# Altium schematic sheet FPGA SYSTERM.SchDoc
size A3
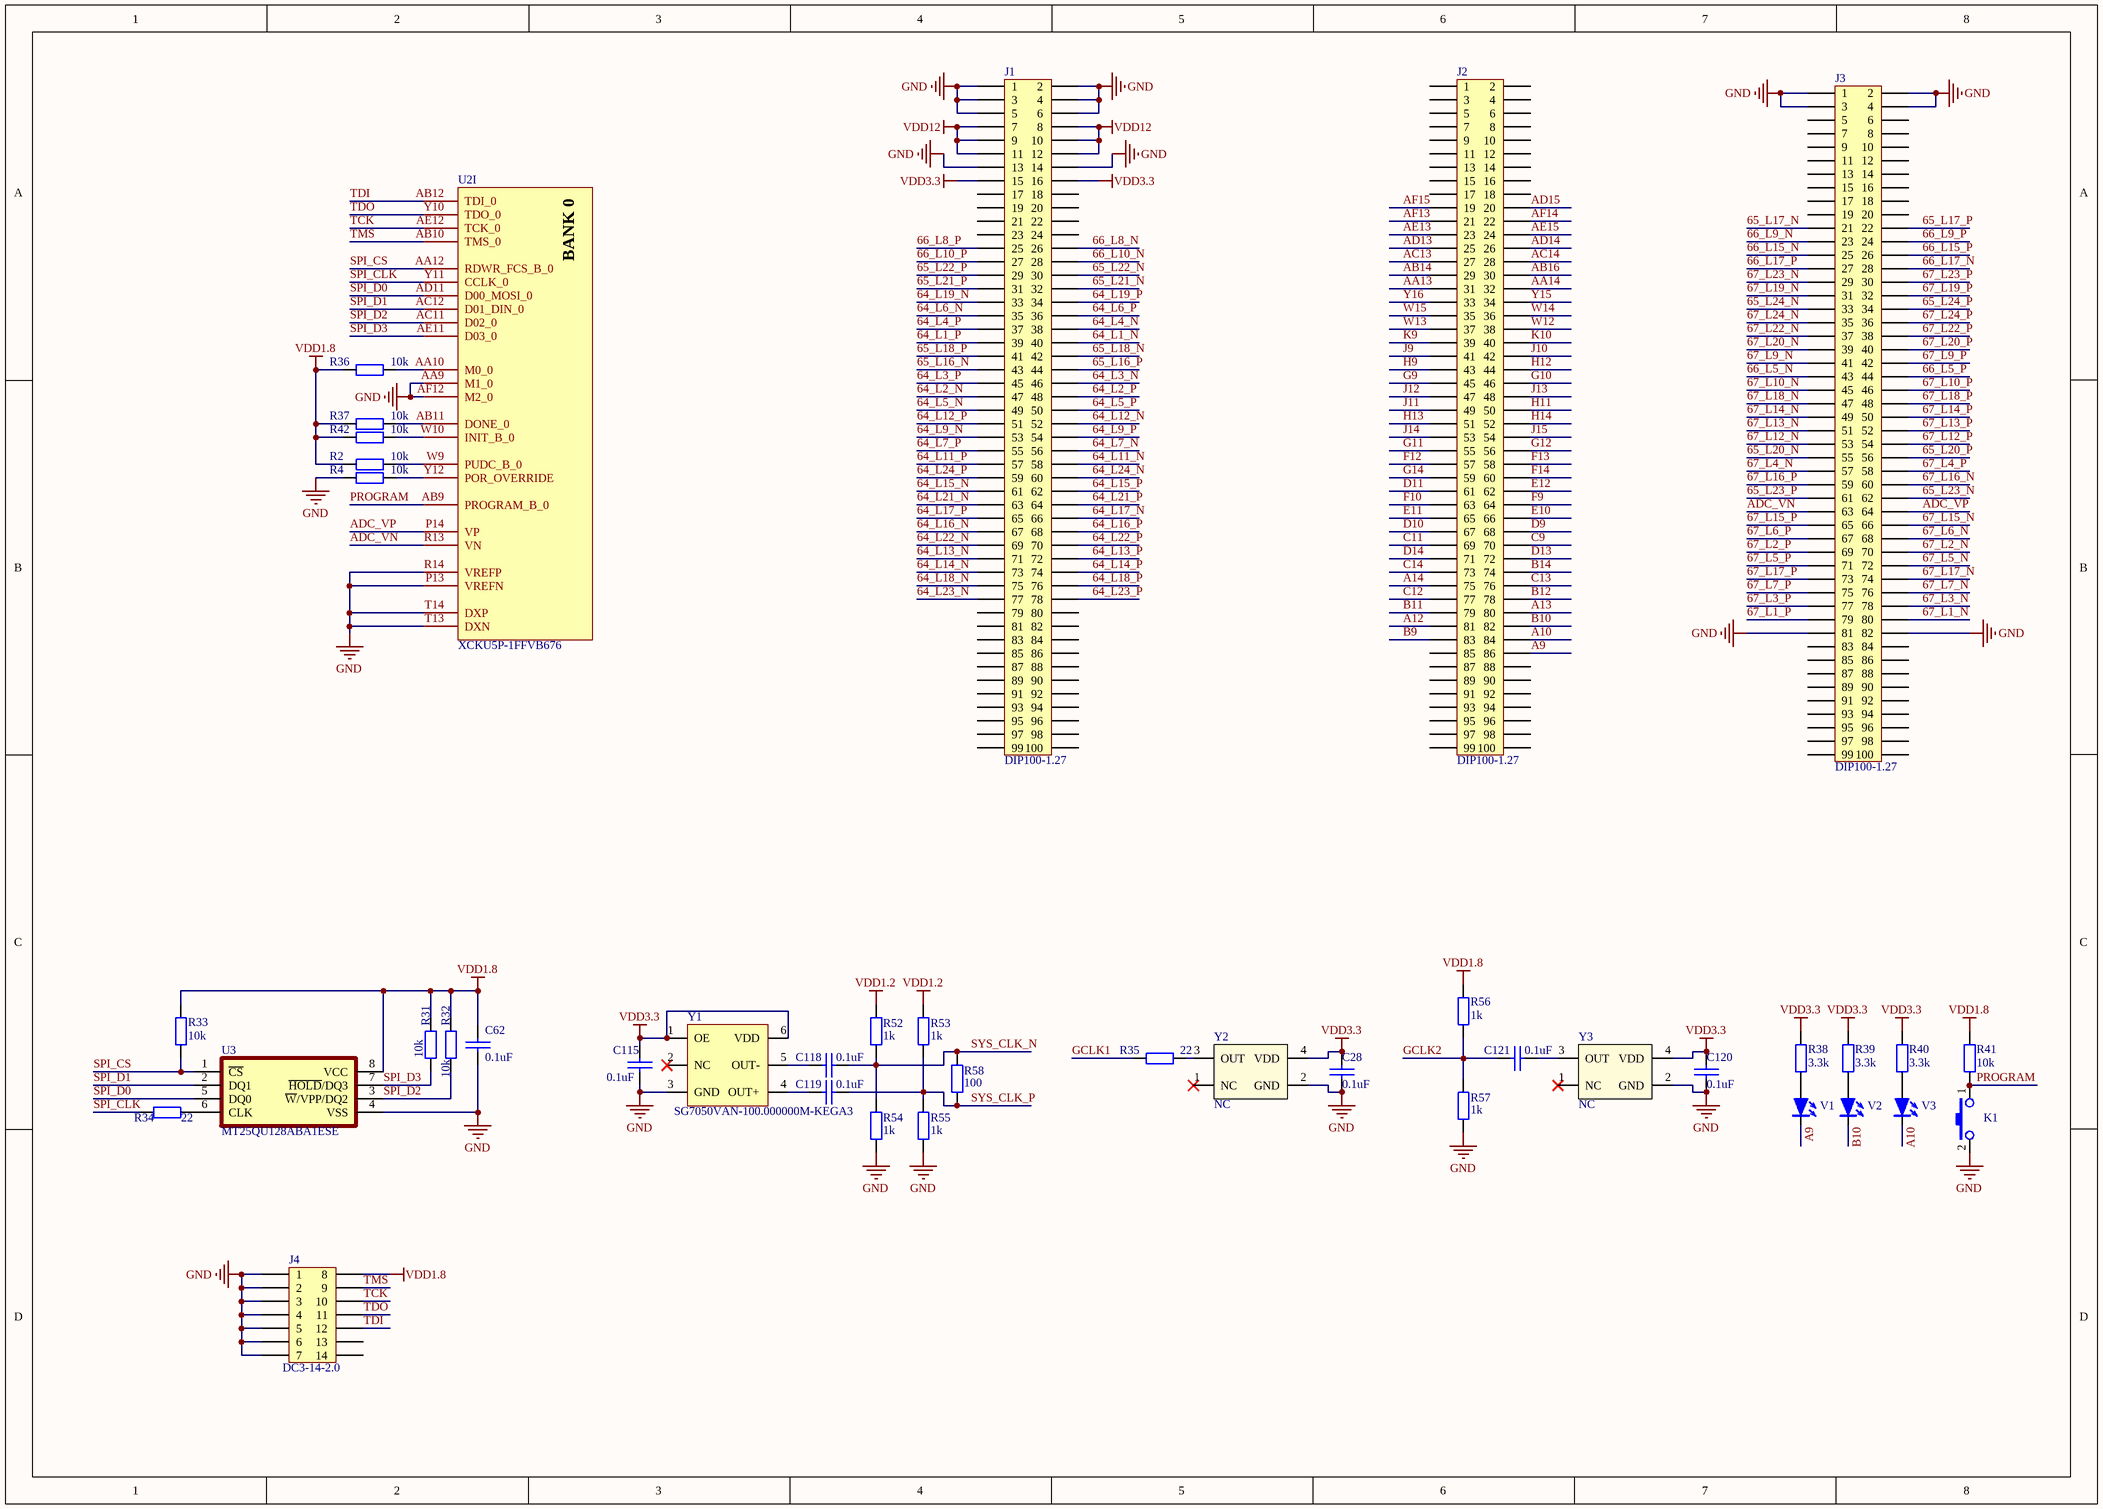
[diagram p0: FPGA SYSTERM.SchDoc]

## Parts
C28  0.1uF  [0402_C_M]
C62  0.1uF  [0402_C_M]
C115  0.1uF  [0402_C_M]
C118  0.1uF  [0402_C_M]
C119  0.1uF  [0402_C_M]
C120  0.1uF  [0402_C_M]
C121  0.1uF  [0402_C_M]
J1  DIP100-1.27  [CON100_1.27]
J2  DIP100-1.27  [CON100_1.27]
J3  DIP100-1.27  [CON100_1.27]
J4  DC3-14-2.0  [DC3-14-2.0]
K1  KEY  [KEY2]  (value not drawn)
R2  10k  [0402_R_M]
R4  10k  [0402_R_M]
R31  10k  [0402_R_M]
R32  10k  [0402_R_M]
R33  10k  [0402_R_M]
R34  22  [0402_R_M]
R35  22  [0402_R_M]
R36  10k  [0402_R_M]
R37  10k  [0402_R_M]
R38  3.3k  [0402_R_M]
R39  3.3k  [0402_R_M]
R40  3.3k  [0402_R_M]
R41  10k  [0402_R_M]
R42  10k  [0402_R_M]
R52  1k  [0402_R_M]
R53  1k  [0402_R_M]
R54  1k  [0402_R_M]
R55  1k  [0402_R_M]
R56  1k  [0402_R_M]
R57  1k  [0402_R_M]
R58  100  [0402_R_M]
U2  XCKU5P-1FFVB676  (part I of 11)
U3  MT25QU128ABA1ESE  [SOP8W]
V1  LED  [0805D]  (value not drawn)
V2  LED  [0805D]  (value not drawn)
V3  LED  [0805D]  (value not drawn)
Y1  SG7050VAN-100.000000M-KEGA3  [OSC 7050-6P]
Y2  NC  [OSC 7050-4P]
Y3  NC  [OSC 7050-4P]

## Nets
GND: C28.2 C62.2 C115.2 C120.2 J1.1 J1.2 J1.3 J1.4 J1.5 J1.6 J1.13 J1.14 J3.1 J3.2 J3.3 J3.4 J3.81 J3.82 J4.1 J4.2 J4.3 J4.4 J4.5 J4.6 J4.7 K1.2 R4.2 R54.2 R55.2 R57.2 U2.AA9(M1_0) U2.AF12(M2_0) U2.P13(VREFN) U2.R14(VREFP) U2.T13(DXN) U2.T14(DXP) U3.4(VSS) Y1.3(GND) Y2.2(GND) Y3.2(GND)
VDD1.2: R52.1 R53.1
VDD1.8: C62.1 J4.8 R2.2 R31.2 R32.2 R33.1 R36.2 R37.2 R41.2 R42.2 R56.1 U3.8(VCC)
VDD3.3: C28.1 C115.1 C120.1 J1.15 J1.16 R38.2 R39.2 R40.2 Y1.1(OE) Y1.6(VDD) Y2.4(VDD) Y3.4(VDD)
VDD12: J1.7 J1.8 J1.9 J1.10 J1.11 J1.12
64_L1_N: J1.40
64_L1_P: J1.39
64_L2_N: J1.47
64_L2_P: J1.48
64_L3_N: J1.46
64_L3_P: J1.45
64_L4_N: J1.38
64_L4_P: J1.37
64_L5_N: J1.49
64_L5_P: J1.50
64_L6_N: J1.35
64_L6_P: J1.36
64_L7_N: J1.56
64_L7_P: J1.55
64_L9_N: J1.53
64_L9_P: J1.54
64_L11_N: J1.58
64_L11_P: J1.57
64_L12_N: J1.52
64_L12_P: J1.51
64_L13_N: J1.71
64_L13_P: J1.72
64_L14_N: J1.73
64_L14_P: J1.74
64_L15_N: J1.61
64_L15_P: J1.62
64_L16_N: J1.67
64_L16_P: J1.68
64_L17_N: J1.66
64_L17_P: J1.65
64_L18_N: J1.75
64_L18_P: J1.76
64_L19_N: J1.33
64_L19_P: J1.34
64_L21_N: J1.63
64_L21_P: J1.64
64_L22_N: J1.69
64_L22_P: J1.70
64_L23_N: J1.77
64_L23_P: J1.78
64_L24_N: J1.60
64_L24_P: J1.59
65_L16_N: J1.43
65_L16_P: J1.44
65_L17_N: J3.21
65_L17_P: J3.22
65_L18_N: J1.42
65_L18_P: J1.41
65_L20_N: J3.55
65_L20_P: J3.56
65_L21_N: J1.32
65_L21_P: J1.31
65_L22_N: J1.30
65_L22_P: J1.29
65_L23_N: J3.62
65_L23_P: J3.61
65_L24_N: J3.33
65_L24_P: J3.34
66_L5_N: J3.43
66_L5_P: J3.44
66_L8_N: J1.26
66_L8_P: J1.25
66_L9_N: J3.23
66_L9_P: J3.24
66_L10_N: J1.28
66_L10_P: J1.27
66_L15_N: J3.25
66_L15_P: J3.26
66_L17_N: J3.28
66_L17_P: J3.27
67_L1_N: J3.80
67_L1_P: J3.79
67_L2_N: J3.70
67_L2_P: J3.69
67_L3_N: J3.78
67_L3_P: J3.77
67_L4_N: J3.57
67_L4_P: J3.58
67_L5_N: J3.72
67_L5_P: J3.71
67_L6_N: J3.68
67_L6_P: J3.67
67_L7_N: J3.76
67_L7_P: J3.75
67_L9_N: J3.41
67_L9_P: J3.42
67_L10_N: J3.45
67_L10_P: J3.46
67_L12_N: J3.53
67_L12_P: J3.54
67_L13_N: J3.51
67_L13_P: J3.52
67_L14_N: J3.49
67_L14_P: J3.50
67_L15_N: J3.66
67_L15_P: J3.65
67_L16_N: J3.60
67_L16_P: J3.59
67_L17_N: J3.74
67_L17_P: J3.73
67_L18_N: J3.47
67_L18_P: J3.48
67_L19_N: J3.31
67_L19_P: J3.32
67_L20_N: J3.39
67_L20_P: J3.40
67_L22_N: J3.37
67_L22_P: J3.38
67_L23_N: J3.29
67_L23_P: J3.30
67_L24_N: J3.35
67_L24_P: J3.36
A9: J2.86 V1.2
A10: J2.84 V3.2
A12: J2.81
A13: J2.80
A14: J2.75
AA13: J2.31
AA14: J2.32
AB14: J2.29
AB16: J2.30
AC13: J2.27
AC14: J2.28
AD13: J2.25
AD14: J2.26
AD15: J2.20
ADC_VN: J3.63 U2.R13(VN)
ADC_VP: J3.64 U2.P14(VP)
AE13: J2.23
AE15: J2.24
AF13: J2.21
AF14: J2.22
AF15: J2.19
B9: J2.83
B10: J2.82 V2.2
B11: J2.79
B12: J2.78
B14: J2.74
C9: J2.70
C11: J2.69
C12: J2.77
C13: J2.76
C14: J2.73
D9: J2.68
D10: J2.67
D11: J2.61
D13: J2.72
D14: J2.71
E10: J2.66
E11: J2.65
E12: J2.62
F9: J2.64
F10: J2.63
F12: J2.57
F13: J2.58
F14: J2.60
G9: J2.45
G10: J2.46
G11: J2.55
G12: J2.56
G14: J2.59
GCLK1: R35.2
GCLK2: C121.1 R56.2 R57.1
H9: J2.43
H11: J2.50
H12: J2.44
H13: J2.51
H14: J2.52
J9: J2.41
J10: J2.42
J11: J2.49
J12: J2.47
J13: J2.48
J14: J2.53
J15: J2.54
K9: J2.39
K10: J2.40
PROGRAM: K1.1 R41.1 U2.AB9(PROGRAM_B_0)
SPI_CLK: R34.2 U2.Y11(CCLK_0)
SPI_CS: R33.2 U2.AA12(RDWR_FCS_B_0) U3.1(~{CS})
SPI_D0: U2.AD11(D00_MOSI_0) U3.5(DQ0)
SPI_D1: U2.AC12(D01_DIN_0) U3.2(DQ1)
SPI_D2: R32.1 U2.AC11(D02_0) U3.3(~{W}/VPP/DQ2)
SPI_D3: R31.1 U2.AE11(D03_0) U3.7(~{HOLD}/DQ3)
SYS_CLK_N: C118.2 R52.2 R54.1 R58.1
SYS_CLK_P: C119.2 R53.2 R55.1 R58.2
TCK: J4.10 U2.AE12(TCK_0)
TDI: J4.12 U2.AB12(TDI_0)
TDO: J4.11 U2.Y10(TDO_0)
TMS: J4.9 U2.AB10(TMS_0)
W12: J2.38
W13: J2.37
W14: J2.36
W15: J2.35
Y15: J2.34
Y16: J2.33
NetC118_1: C118.1 Y1.5(OUT-)
NetC119_1: C119.1 Y1.4(OUT+)
NetC121_2: C121.2 Y3.3(OUT)
NetR2_1: R2.1 U2.W9(PUDC_B_0)
NetR4_1: R4.1 U2.Y12(POR_OVERRIDE)
NetR34_1: R34.1 U3.6(CLK)
NetR35_1: R35.1 Y2.3(OUT)
NetR36_1: R36.1 U2.AA10(M0_0)
NetR37_1: R37.1 U2.AB11(DONE_0)
NetR38_1: R38.1 V1.1
NetR39_1: R39.1 V2.1
NetR40_1: R40.1 V3.1
NetR42_1: R42.1 U2.W10(INIT_B_0)

Not connected (* = marked no-connect by the designer): J1 17 18 19 20 21 22 23 24 79 80 81 82 83 84 85 86 87 88 89 90 91 92 93 94 95 96 97 98 99 100; J2 1 2 3 4 5 6 7 8 9 10 11 12 13 14 15 16 17 18 85 87 88 89 90 91 92 93 94 95 96 97 98 99 100; J3 5 6 7 8 9 10 11 12 13 14 15 16 17 18 19 20 83 84 85 86 87 88 89 90 91 92 93 94 95 96 97 98 99 100; J4 13 14; Y1 2(NC)*; Y2 1(NC)*; Y3 1(NC)*

## Notes on the sheet
- (in symbol XCKU5P-FFVB676, part I) BANK 0

## Library data of the parts
C28 C62 C115 C118-C121 = CAP
J1-J3 = CON100
J4 = CON14
K1 = KEY1
R2 R4 R31-R42 R52-R58 = RES2
U2 = XCKU5P-FFVB676
U3 = N25Q128A11EF840E
V1-V3 = LED2
Y1 = OB7050100MLDB6SI-00
Y2 Y3 = XTAL